# EAGLE design SlaveProtect (EAGLE 9.2.2)
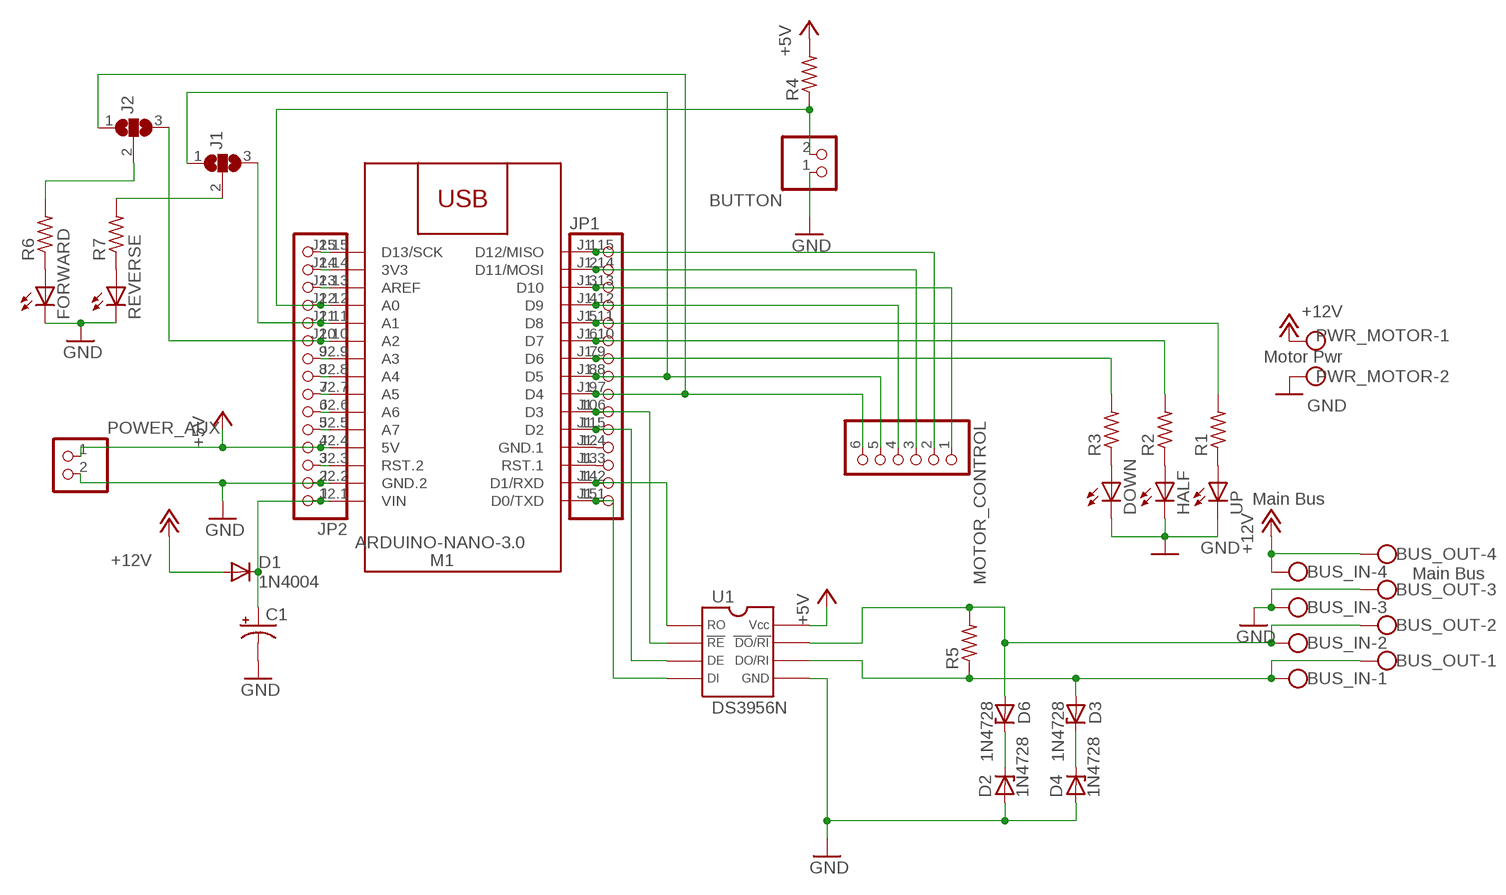
[diagram p0: schematic, sheet 1]

## Parts
BUS_IN  Main Bus  W237-4  [W237-4]
BUS_OUT  Main Bus  W237-4  [W237-4]
BUTTON  PINHD-1X2  [1X02]
C1  CPOL-USE3.5-10  [E3,5-10]
D1  1N4004  [DO41-10]
D2  1N4728  [DO41Z10]
D3  1N4728  [DO41Z10]
D4  1N4728  [DO41Z10]
D6  1N4728  [DO41Z10]
DOWN  LED5MM  [LED5MM]
FORWARD  LED5MM  [LED5MM]
HALF  LED5MM  [LED5MM]
J1  SJ2W  [SJ_2]
J2  SJ2W  [SJ_2]
JP1  PINHD-1X15-CB  [1X15-CB]
JP2  PINHD-1X15-CB  [1X15-CB]
M1  ARDUINO-NANO-3.0  [ARDUINO-NANO-3.0]
MOTOR_CONTROL  PINHD-1X6  [1X06]
POWER_AUX  PINHD-1X2  [1X02]
PWR_MOTOR  Motor Pwr  W237-102  [W237-102]
R1  FLIPFLOP-RES  [0805-THM]
R2  FLIPFLOP-RES  [0805-THM]
R3  FLIPFLOP-RES  [0805-THM]
R4  FLIPFLOP-RES  [0805-THM]
R5  FLIPFLOP-RES  [0805-THM]
R6  FLIPFLOP-RES  [0805-THM]
R7  FLIPFLOP-RES  [0805-THM]
REVERSE  LED5MM  [LED5MM]
U1  DS3956N  [DIL08]
UP  LED5MM  [LED5MM]

## Nets
+5V: JP2.4 M1.J2.4(5V) POWER_AUX.1 R4.2 U1.8(VCC)
+12V: BUS_IN.4 BUS_OUT.4 D1.A PWR_MOTOR.1
GND: BUS_IN.3 BUS_OUT.3 BUTTON.1 C1.- D2.A D4.A DOWN.K(C) FORWARD.K(C) HALF.K(C) JP2.2 M1.J2.2(GND.2) POWER_AUX.2 PWR_MOTOR.2 REVERSE.K(C) U1.5(GND) UP.K(C)
N$1: R1.1 UP.A
N$2: HALF.A R2.1
N$3: DOWN.A R3.1
N$4: BUTTON.2 JP2.12 M1.J2.12(A0) R4.1
N$5: BUS_IN.1 BUS_OUT.1 D3.A R5.1 U1.6(DO/RI)
N$6: BUS_IN.2 BUS_OUT.2 D6.A R5.2 U1.7(_DO/RI_)
N$7: JP1.10 M1.J1.6(D3) U1.2(_RE_)
N$8: JP1.11 M1.J1.5(D2) U1.3(DE)
N$9: JP1.14 M1.J1.2(D1/RXD) U1.1(RO)
N$10: JP1.15 M1.J1.1(D0/TXD) U1.4(DI)
N$11: JP1.7 M1.J1.9(D6) R3.2
N$12: JP1.6 M1.J1.10(D7) R2.2
N$13: JP1.5 M1.J1.11(D8) R1.2
N$14: J1.1 JP1.8 M1.J1.8(D5) MOTOR_CONTROL.5
N$15: J1.2 R7.2
N$16: C1.+ D1.C JP2.1 M1.J2.1(VIN)
N$18: FORWARD.A R6.1
N$19: R7.1 REVERSE.A
N$20: D2.C D6.C
N$21: D3.C D4.C
N$22: JP2.3 M1.J2.3(RST.2)
N$23: JP2.5 M1.J2.5(A7)
N$24: JP2.6 M1.J2.6(A6)
N$25: JP2.7 M1.J2.7(A5)
N$26: JP2.8 M1.J2.8(A4)
N$27: JP2.9 M1.J2.9(A3)
N$28: J2.3 JP2.10 M1.J2.10(A2)
N$29: J1.3 JP2.11 M1.J2.11(A1)
N$30: J2.1 JP1.9 M1.J1.7(D4) MOTOR_CONTROL.6
N$31: JP2.13 M1.J2.13(AREF)
N$32: JP2.14 M1.J2.14(3V3)
N$33: JP2.15 M1.J2.15(D13/SCK)
N$34: JP1.1 M1.J1.15(D12/MISO) MOTOR_CONTROL.2
N$35: JP1.2 M1.J1.14(D11/MOSI) MOTOR_CONTROL.3
N$36: JP1.3 M1.J1.13(D10) MOTOR_CONTROL.1
N$37: JP1.12 M1.J1.4(GND.1)
N$38: JP1.13 M1.J1.3(RST.1)
N$39: JP1.4 M1.J1.12(D9) MOTOR_CONTROL.4
N$42: J2.2 R6.2

## Library data of the parts
BUS_IN BUS_OUT = con-wago-500:W237-4: WAGO SCREW CLAMP; OC_FARNELL: unknown; OC_NEWARK: unknown
BUTTON POWER_AUX = pinhead:PINHD-1X2: PIN HEADER
C1 = adafruit:CPOL-US: POLARIZED CAPACITOR, American symbol
D1 = adafruit:1N4004: DIODE General purpose 1N400x type rectifier (With bigger pads) http://www.ladyada.net/library/pcb/eaglelibrary.html
D2-D4 D6 = diode:1N4728: Z DIODE 3.3 V, 1W, 5 percent
DOWN FORWARD HALF REVERSE UP = adafruit:LED: LED OSRAM: - CHIPLED LG R971, LG N971, LY N971, LG Q971, LY Q971, LO R971, LY R971 LH N974, LH R974 LS Q976, LO Q976, LY Q976 LO Q996 - Hyper CHIPLED LW Q18S LB Q993, LB Q99A, LB R99A - SideLED LS A670, LO A670, LY A670, LG A670, LP A670 LB A673, LV A673, LT A673, LW A673 LH A674 LY A675 LS A676, LA A676, LO A676, LY A676, LW A676 LS A679, LY A679, LG A679 - Hyper Micro SIDELED® LS Y876, LA Y876, LO Y876, LY Y876 LT Y87S - SmartLED LW L88C, LW L88S LB L89C, LB L89S, LG L890 LS L89K, LO L89K, LY L89K LS L896, LA L896, LO L896, LY L896 - TOPLED LS T670, LO T670, LY T670, LG T670, LP T670 LSG T670, LSP T670, LSY T670, LOP T670, LYG T670 LG T671, LOG T671, LSG T671 LB T673, LV T673, LT T673, LW T673 LH T674 LS T676, LA T676, LO T676, LY T676, LB T676, LH T676, LSB T676, LW T676 LB T67C, LV T67C, LT T67C, LS T67K, LO T67K, LY T67K, LW E67C LS E67B, LA E67B, LO E67B, LY E67B, LB E67C, LV E67C, LT E67C LW T67C LS T679, LY T679, LG T679 LS T770, LO T770, LY T770, LG T770, LP T770 LB T773, LV T773, LT T773, LW T773 LH T774 LS E675, LA E675, LY E675, LS T675 LS T776, LA T776, LO T776, LY T776, LB T776 LHGB T686 LT T68C, LB T68C - Hyper Mini TOPLED® LB M676 - Mini TOPLED Santana® LG M470 LS M47K, LO M47K, LY M47K Source: http://www.osram.convergy.de/
J1 J2 = jumper:SJ2W: SMD solder JUMPER
JP1 JP2 = adafruit:PINHD-1X15: PIN HEADER
M1 = diy-modules:ARDUINO-NANO-3.0: Arduino Nano 3.0
MOTOR_CONTROL = adafruit:PINHD-1X6: PIN HEADER
PWR_MOTOR = con-wago-500:W237-102: WAGO SCREW CLAMP; MPN: 237-102; OC_FARNELL: unknown; OC_NEWARK: 70K9898
R1-R7 = adafruit:FLIPFLOP-RES: Flip Flop resistor An 0805 resistor inside a standard 1/4W 5% resistor. Makes for easy mods
U1 = DS3695N_RS485_Transceiver:DS3956N: DS35695N rs485 Transiever

## Net classes
0 default: width 0.025 mm, clearance 0.205 mm

## Board
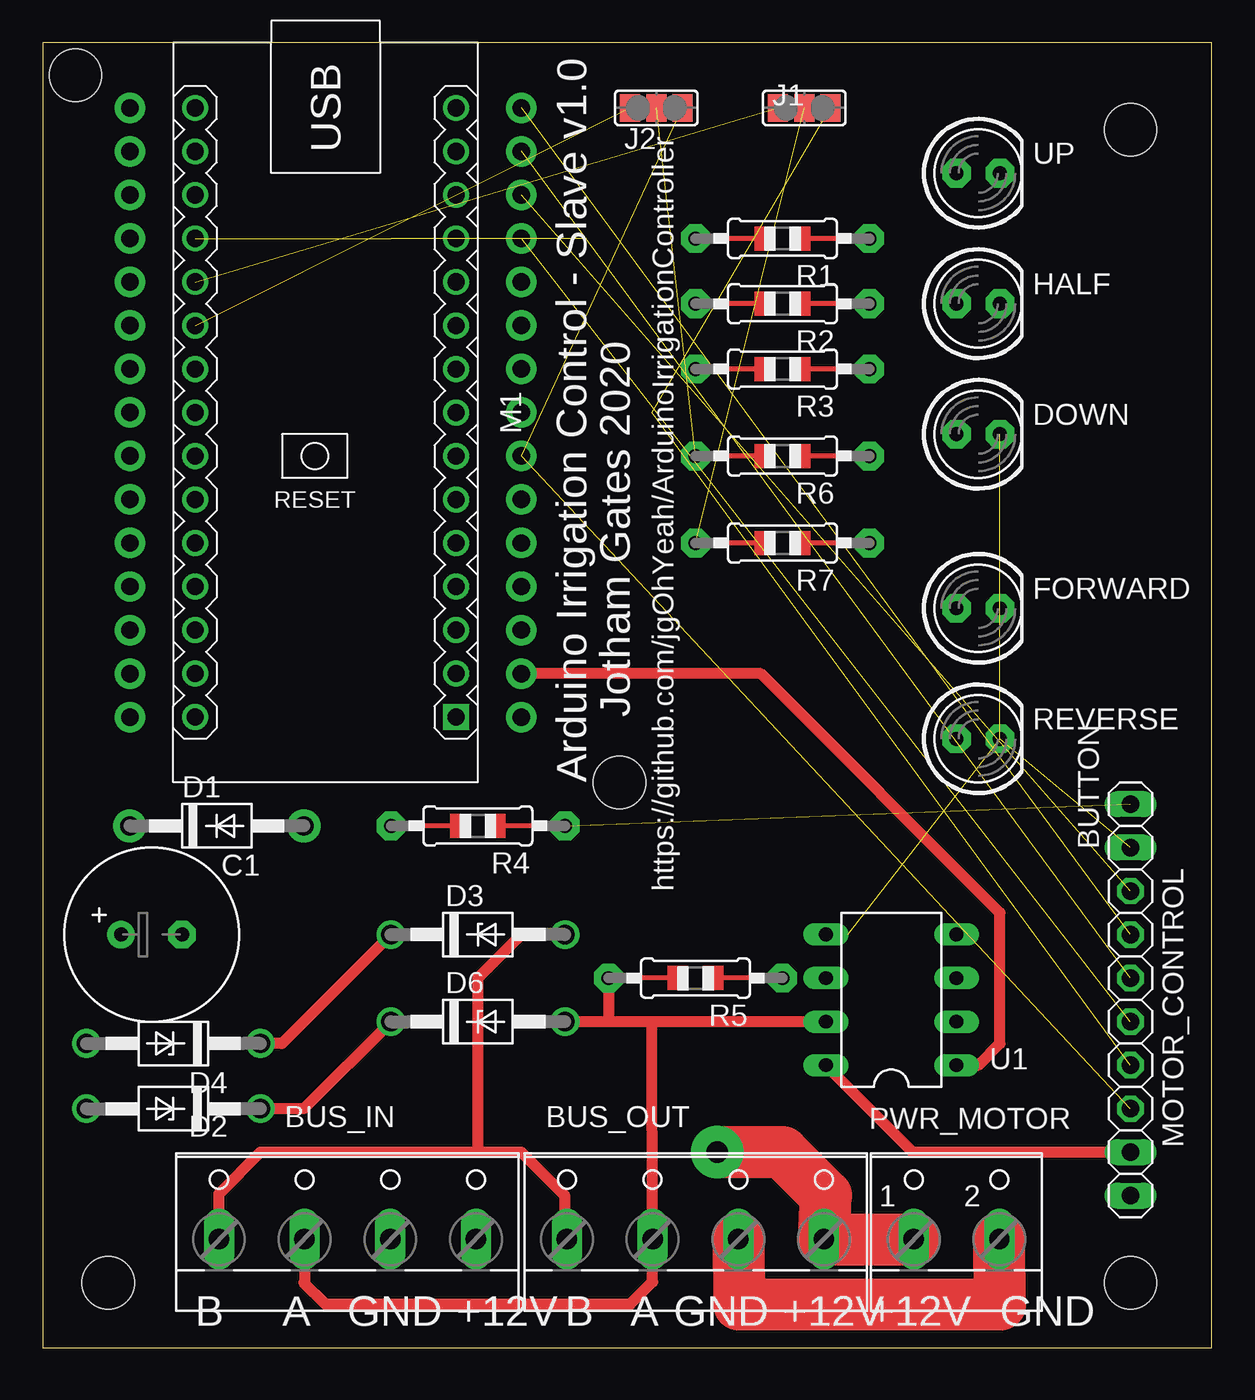
[diagram p1: board, top side]
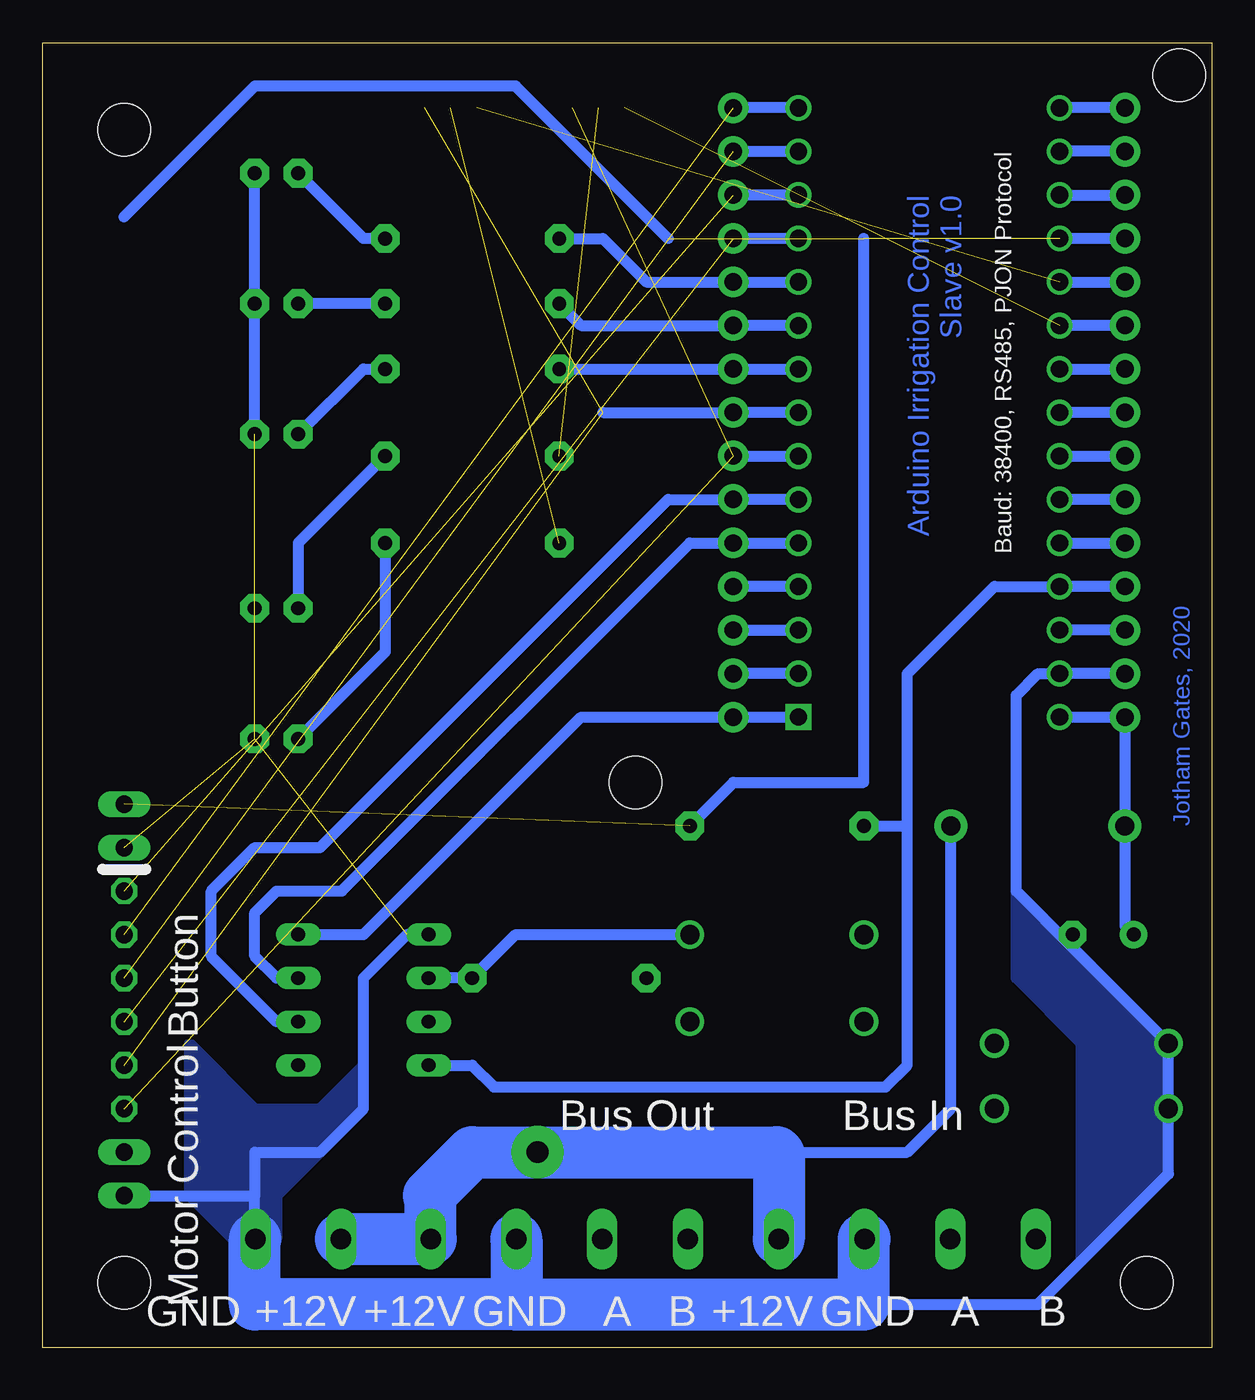
[diagram p2: board, bottom side, seen from below]

Size 68.25 x 76.19 mm. Coordinates in mm from the lower left corner, seen from the top.
Outline: 0,0 68.25,0 68.25,76.19 0,76.19 0,0
Copper layers (1*16): Top 0.035mm / dielectric 1.5mm / Bottom 0.035mm
Design rules "default": minimum track width 6mil, minimum drill 0.35mm, track to track 6mil, track to pad 6mil, pad to pad 6mil, via to via 6mil, smd to smd 6mil, copper to edge 40mil, drill to drill 6mil, minimum pad ring 10mil, minimum via ring 8mil, stop-mask expansion 4mil, vias tented up to drill 0mil, thermal gap 10mil
Holes 3.05 mm at 3.81,3.81 63.5,3.81 1.91,74.3 63.5,71.12 33.66,33.02

### Footprints (pad centres in the part's own frame; a part is rotated, then mirrored left to right if it is on the bottom)
W237-4 = drill 1.194 long: 1 -7.5,-1.27; 2 -2.5,-1.27; 3 2.5,-1.27; 4 7.5,-1.27
1X02 = drill 1.016 long: 1 -1.27,0; 2 1.27,0
E3,5-10 = drill 0.813 pad 1.6: + -1.778,0 | drill 0.813 pad 1.6 octagon: - 1.778,0
DO41-10 = drill 1.118 pad 1.93: A 5.08,0; C -5.08,0
DO41Z10 = drill 1.118: A 5.08,0; C -5.08,0
LED5MM = drill 0.813 pad 1.676 octagon: A -1.27,0; K 1.27,0
SJ_2 = smd 1.168 x 1.6: 1 -1.524,0; 2 0,0; 3 1.524,0
1X15-CB = drill 1.016 pad 1.778: 1 -17.78,0; 2 -15.24,0; 3 -12.7,0; 4 -10.16,0; 5 -7.62,0; 6 -5.08,0; 7 -2.54,0; 8 0,0; 9 2.54,0; 10 5.08,0; 11 7.62,0; 12 10.16,0; 13 12.7,0; 14 15.24,0; 15 17.78,0
ARDUINO-NANO-3.0 = drill 1 square: J1.1 17.78,7.62 | drill 1: J1.2 15.24,7.62; J1.3 12.7,7.62; J1.4 10.16,7.62; J1.5 7.62,7.62; J1.6 5.08,7.62; J1.7 2.54,7.62; J1.8 0,7.62; J1.9 -2.54,7.62; J1.10 -5.08,7.62; J1.11 -7.62,7.62; J1.12 -10.16,7.62; J1.13 -12.7,7.62; J1.14 -15.24,7.62; J1.15 -17.78,7.62; J2.1 17.78,-7.62; J2.2 15.24,-7.62; J2.3 12.7,-7.62; J2.4 10.16,-7.62; J2.5 7.62,-7.62; J2.6 5.08,-7.62; J2.7 2.54,-7.62; J2.8 0,-7.62; J2.9 -2.54,-7.62; J2.10 -5.08,-7.62; J2.11 -7.62,-7.62; J2.12 -10.16,-7.62; J2.13 -12.7,-7.62; J2.14 -15.24,-7.62; J2.15 -17.78,-7.62
1X06 = drill 1.016 octagon: 1 -6.35,0; 2 -3.81,0; 3 -1.27,0; 4 1.27,0; 5 3.81,0; 6 6.35,0
W237-102 = drill 1.194 long: 1 -2.5,-1.27; 2 2.5,-1.27
0805-THM = drill 0.813 pad 1.676 octagon: 1 -5.08,0; 2 5.08,0
DIL08 = drill 0.813 long: 1 -3.81,-3.81; 2 -1.27,-3.81; 3 1.27,-3.81; 4 3.81,-3.81; 5 3.81,3.81; 6 1.27,3.81; 7 -1.27,3.81; 8 -3.81,3.81

### Placement (x,y rotation side)
BUS_IN  17.78,7.62 0 top
BUS_OUT  38.1,7.62 0 top
BUTTON  63.5,30.48 90 top
C1  6.35,24.13 0 top
D1  10.16,30.48 0 top
D2  7.62,13.97 180 top
D3  25.4,24.13 0 top
D4  7.62,17.78 180 top
D6  25.4,19.05 0 top
DOWN  54.61,53.34 0 top
FORWARD  54.61,43.18 0 top
HALF  54.61,60.96 0 top
J1  44.45,72.39 180 top
J2  35.81,72.39 180 top
JP1  27.94,54.61 270 top
JP2  5.08,54.61 90 top
M1  16.51,54.61 270 top
MOTOR_CONTROL  63.5,20.32 270 top
POWER_AUX  63.5,10.16 270 top
PWR_MOTOR  53.34,7.62 0 top
R1  43.18,64.77 180 top
R2  43.18,60.96 180 top
R3  43.18,57.15 180 top
R4  25.4,30.48 180 top
R5  38.1,21.59 180 top
R6  43.18,52.07 180 top
R7  43.18,46.99 180 top
REVERSE  54.61,35.56 0 top
U1  49.53,20.32 90 top
UP  54.61,68.58 0 top

### Tracks (layer width: path | path; a pad name or v marks a point on that pad's centre or on a via)
+5V
  Top 0.635: POWER_AUX.1 50.8,11.43 U1.8
  Bottom 0.635: U1.8 43.18,16.51 41.91,15.24 19.05,15.24 17.78,16.51 17.78,30.48 | 17.78,30.48 17.78,39.37 12.7,44.45 M1.J2.4 JP2.4 | R4.2 17.78,30.48
+12V  (via drill 1.27 pad 3.05)
  Top 3.048: PWR_MOTOR.1 BUS_OUT.4 45.72,8.89 43.18,11.43 v39.37,11.43
  Bottom 0.635: 25.4,11.43 17.78,11.43 15.24,13.97 D1.A
  Bottom 3.048: PWR_MOTOR.1 BUS_OUT.4 45.6,8.77 45.72,8.89 43.18,11.43 v39.37,11.43 25.4,11.43 25.28,11.31 BUS_IN.4
GND  (4 unrouted)
  Top 3.048: BUS_OUT.3 40.64,2.54 55.88,2.54 PWR_MOTOR.2
  Bottom 0.635: JP2.2 M1.J2.2 10.16,39.37 11.43,38.1 11.43,26.67 8.13,23.37 | 20.32,2.54 10.16,2.54 2.54,10.16 D2.A D4.A 8.13,23.37 | DOWN.K HALF.K UP.K | 55.88,8.89 55.88,11.43 52.07,11.43 49.53,13.97 49.53,21.59 46.99,24.13 U1.5 | POWER_AUX.2 55.88,8.89 | PWR_MOTOR.2 55.88,6.39 55.88,8.89 | C1.- 8.13,23.37
  Bottom 3.048: BUS_OUT.3 40.6,2.58 | 40.6,2.58 40.64,2.54 55.88,2.54 55.88,6.35 PWR_MOTOR.2 | 40.6,2.58 40.56,2.54 20.32,2.54 20.32,6.35 BUS_IN.3
  pour Bottom (no thermals): 59.69,8.89 59.69,17.78 55.88,13.97 49.53,13.97 54.61,8.89 54.61,6.35 57.15,6.35
  pour Bottom: 52.07,13.97 49.53,13.97 49.53,16.51
  pour Bottom (no thermals): 7.62,5.08 7.62,17.78 11.43,21.59 11.43,26.67 2.54,17.78 2.54,10.16
N$1
  Bottom 0.635: UP.A 49.53,64.77 R1.1
N$2
  Bottom 0.635: R2.1 HALF.A
N$3
  Bottom 0.635: DOWN.A 49.53,57.15 R3.1
N$4  (3 unrouted)
  Bottom 0.635: R4.1 27.94,33.02 20.32,33.02 20.32,63.5 20.32,64.77 | 31.75,64.77 40.64,73.66 55.88,73.66 63.5,66.04 | JP2.12 M1.J2.12
N$5
  Top 0.635: BUS_IN.1 10.28,9.01 12.7,11.43 25.4,11.43 | BUS_OUT.1 30.48,6.47 30.48,8.89 27.94,11.43 25.4,11.43 | 25.4,11.43 25.4,21.59 27.94,24.13 D3.A
  Bottom 0.635: D3.A 40.64,24.13 R5.1 U1.6
N$6
  Top 0.635: BUS_IN.2 15.28,3.85 15.24,3.81 16.51,2.54 34.29,2.54 35.6,3.85 BUS_OUT.2 35.56,19.05 | U1.7 35.56,19.05 | 35.56,19.05 33.02,19.05 | 33.02,19.05 D6.A | R5.2 33.02,19.05
N$7
  Bottom 0.635: U1.2 54.61,19.05 58.42,22.86 58.42,26.67 55.88,29.21 52.07,29.21 31.75,49.53 JP1.10 M1.J1.6
N$8
  Bottom 0.635: U1.3 54.61,21.59 55.88,22.86 55.88,25.4 54.61,26.67 50.8,26.67 30.48,46.99 JP1.11 M1.J1.5
N$9
  Top 0.635: U1.1 54.61,16.51 55.88,17.78 55.88,25.4 41.91,39.37 JP1.14
  Bottom 0.635: M1.J1.2 JP1.14
N$10
  Bottom 0.635: U1.4 49.53,24.13 36.83,36.83 JP1.15 M1.J1.1
N$11
  Bottom 0.635: R3.2 JP1.7 M1.J1.9
N$12
  Bottom 0.635: R2.2 36.83,59.69 JP1.6 M1.J1.10
N$13
  Bottom 0.635: R1.2 35.56,64.77 33.02,62.23 JP1.5 M1.J1.11
N$14  (2 unrouted)
  Bottom 0.635: 35.56,54.61 JP1.8 M1.J1.8
N$15  (1 unrouted)
N$16
  Bottom 0.635: M1.J2.1 JP2.1 D1.C 5.08,24.64 C1.+
N$18
  Bottom 0.635: R6.1 53.34,46.99 FORWARD.A
N$19
  Bottom 0.635: R7.1 48.26,40.64 REVERSE.A
N$20
  Top 0.635: D6.C 15.24,13.97 D2.C
N$21
  Top 0.635: D3.C 13.97,17.78 D4.C
N$22
  Bottom 0.635: JP2.3 M1.J2.3
N$23
  Bottom 0.635: M1.J2.5 JP2.5
N$24
  Bottom 0.635: JP2.6 M1.J2.6
N$25
  Bottom 0.635: M1.J2.7 JP2.7
N$26
  Bottom 0.635: JP2.8 M1.J2.8
N$27
  Bottom 0.635: M1.J2.9 JP2.9
N$28  (1 unrouted)
  Bottom 0.635: JP2.10 M1.J2.10
N$29  (1 unrouted)
  Bottom 0.635: M1.J2.11 JP2.11
N$30  (2 unrouted)
  Bottom 0.635: JP1.9 M1.J1.7
N$31
  Bottom 0.635: M1.J2.13 JP2.13
N$32
  Bottom 0.635: JP2.14 M1.J2.14
N$33
  Bottom 0.635: JP2.15 M1.J2.15
N$34  (1 unrouted)
  Bottom 0.635: M1.J1.15 JP1.1
N$35  (1 unrouted)
  Bottom 0.635: JP1.2 M1.J1.14
N$36  (1 unrouted)
  Bottom 0.635: M1.J1.13 JP1.3
N$37
  Bottom 0.635: M1.J1.4 JP1.12
N$38
  Bottom 0.635: JP1.13 M1.J1.3
N$39  (1 unrouted)
  Bottom 0.635: M1.J1.12 JP1.4
N$42  (1 unrouted)

### Text on the board
Bottom: Arduino Irrigation Control / Slave v1.0 | Jotham Gates, 2020
tPlace: Jotham Gates 2020 | Arduino Irrigation Control - Slave v1.0 | https://github.com/jgOhYeah/ArduinoIrrigationController | B | A | GND | +12V | B | A | GND | +12V | +12V | GND
bPlace: Baud: 38400, RS485, PJON Protocol | Button | Motor Control | Bus In | Bus Out | B | A | GND | +12V | B | A | GND | +12V | +12V | GND